# Altium project RLC.PrjPcb
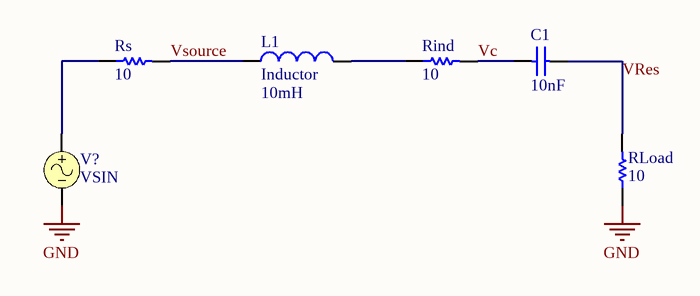
[diagram p0: RLC.SchDoc]
1 sheet, 6 parts. Net scope: global (net labels, ports and power ports of the same name join across sheets).

## Sheet RLC.SchDoc
size Letter

### Parts
C1  10nF  [RAD-0.3]
L1  Inductor  value 10mH  [0402-A]
Rind  10  [AXIAL-0.3]
RLoad  10  [AXIAL-0.3]
Rs  10  [AXIAL-0.3]
V?  VSIN

### Nets
GND: RLoad.1 V?.2
Vc: C1.1 Rind.2
VRes: C1.2 RLoad.2
Vsource: L1.1 Rs.2
NetL1_2: L1.2 Rind.1
NetRs_1: Rs.1 V?.1

### Library data of the parts
C1 = Cap: Capacitor; Published: 8-Jun-2000; LatestRevisionDate: 17-Jul-2002; LatestRevisionNote: Re-released for DXP Platform.; PackageReference: RAD-0.3; Publisher: Altium Limited; PackageDescription: Radial Cap, Thru-Hole; 2 Leads; 0.3 in Pin Spacing; Value: 10nF
L1 = Inductor: Code_IEC: 1005; Published: 8-Jun-2000; LatestRevisionDate: 29-May-2009; LatestRevisionNote: IPC-7351 Footprint Added.; PackageReference: 0402-A; Publisher: Altium Limited; PackageDescription: Chip Inductor; Code_JEITA: 0402
Rind RLoad Rs = Res1: Resistor; Published: 8-Jun-2000; LatestRevisionDate: 17-Jul-2002; LatestRevisionNote: Re-released for DXP Platform.; PackageReference: AXIAL-0.3; Publisher: Altium Limited; PackageDescription: Axial Device, Thru-Hole; 2 Leads; 0.3 in Pin Spacing; Value: 10
V? = VSIN: Sinusoidal Voltage Source; Note: PCB Footprint - Not required; Published: 8-Jun-2000; LatestRevisionDate: 15-Nov-2004; LatestRevisionNote: Corrected Netlist.; PackageReference: Not Applicable; Publisher: Altium Limited